# EAGLE design board (EAGLE 9.6.2)
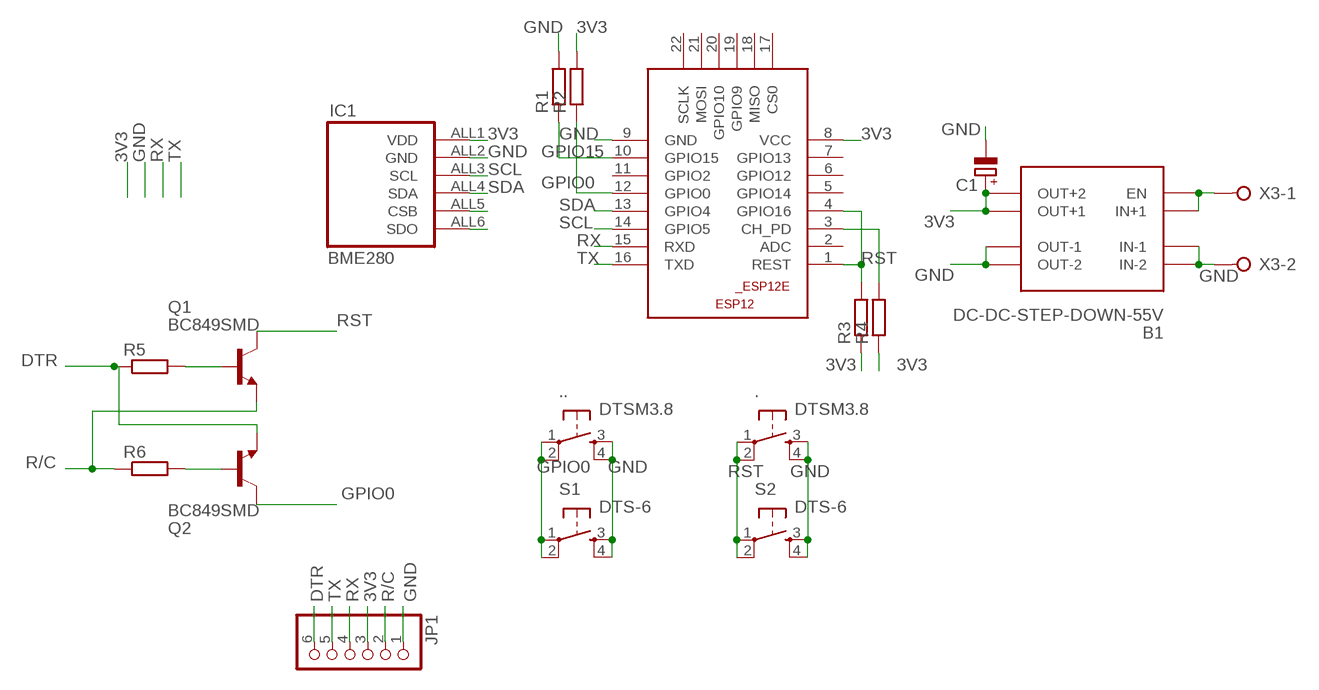
[diagram p0: schematic, sheet 1]

## Parts
.  DTSM3.8  [DTSM3.8]
..  DTSM3.8  [DTSM3.8]
B1  DC-DC-STEP-DOWN-55V  [DC-DC-STEP-DOWN-55V]
C1  CPOL-EUE1.8-4  [E1,8-4]
ESP12  ESP8266-12EESP12E  [ESP8266-ESP12E]
IC1  BME280  [BME280]
JP1  PINHD-1X6/90  [1X06/90]
Q1  BC849SMD  [SOT23-BEC]
Q2  BC849SMD  [SOT23-BEC]
R1  R-EU_R1206  [R1206]
R2  R-EU_R1206  [R1206]
R3  R-EU_0207/10  [0207/10]
R4  R-EU_0207/10  [0207/10]
R5  R-EU_R1206  [R1206]
R6  R-EU_R1206  [R1206]
S1  DTS-6  [DTS-6]
S2  DTS-6  [DTS-6]
X3  W237-02P  [W237-132]

## Nets
3V3: B1.VOUT+1(OUT+1) B1.VOUT+2(OUT+2) C1.+ ESP12.8(VCC) IC1.ALL1(VDD) JP1.3 R2.2 R3.1 R4.1
DTR: JP1.6 Q2.E R5.1
GND: ..3 ..4 ...3 ...4 B1.VIN-1(IN-1) B1.VIN-2(IN-2) B1.VOUT-1(OUT-1) B1.VOUT-2(OUT-2) C1.- ESP12.9(GND) IC1.ALL2(GND) JP1.1 R1.2 S1.3 S1.4 S2.3 S2.4 X3.2
GPIO0: ...1 ...2 ESP12.12(GPIO0) Q2.C R2.1 S1.1 S1.2
GPIO15: ESP12.10(GPIO15) R1.1
N$1: ESP12.3(CH_PD) R4.2
N$2: B1.EN B1.VIN+(IN+1) X3.1
N$3: Q1.B R5.2
N$4: Q2.B R6.2
N$6: IC1.ALL5(CSB)
N$7: IC1.ALL6(SDO)
R/C: JP1.2 Q1.E R6.1
RST: ..1 ..2 ESP12.1(REST) ESP12.4(GPIO16) Q1.C R3.2 S2.1 S2.2
RX: ESP12.15(RXD) JP1.4
SCL: ESP12.14(GPIO5) IC1.ALL3(SCL)
SDA: ESP12.13(GPIO4) IC1.ALL4(SDA)
TX: ESP12.16(TXD) JP1.5
Unconnected: ESP12.2(ADC) ESP12.5(GPIO14) ESP12.6(GPIO12) ESP12.7(GPIO13) ESP12.11(GPIO2) ESP12.17(CS0) ESP12.18(MISO) ESP12.19(GPIO9) ESP12.20(GPIO10) ESP12.21(MOSI) ESP12.22(SCLK)

## Library data of the parts
. .. = switch-tact:DTSM3.8
B1 = diy-modules:DC-DC-STEP-DOWN-55V
C1 = rcl:CPOL-EU: POLARIZED CAPACITOR, European symbol; SPICEPREFIX: C
ESP12 = esp12e:ESP8266-12E: ESP8266-12E Library for Eagle CAD The author not responsible for any damages or errors!. Created by Suhail jr.lt;/author>
IC1 = bme280:BME280: DIGITAL HUMIDITY, PRESSURE AND TEMPERATURE SENSOR * Digital interface I²C (up to 3.4 MHz) and SPI (3 and 4 wire, up to 10 MHz)* Supply voltage VDD main supply voltage range: 1.71 V to 3.6 V*VDDIO interface voltage range: 1.2 V to 3.6 V Operating range -40…+85 °C, 0…100 % rel. humidity, 300…1100 hPa The library has been designed by Richard Magdycz <https://www.facebook.com/groups/eaglecadsoftUK>
JP1 = pinhead:PINHD-1X6: PIN HEADER
Q1 Q2 = transistor-npn:BC849*: NPN Transistor
R1-R6 = rcl:R-EU_: RESISTOR, European symbol; SPICEPREFIX: R
S1 S2 = switch-tact:DTS-6
X3 = con-wago-508:W237-02P: WAGO SREW CLAMP; OC_FARNELL: unknown; OC_NEWARK: unknown

## Net classes
0 default: width 0.406 mm, drill 0.406 mm, clearance 0.406 mm

## Board
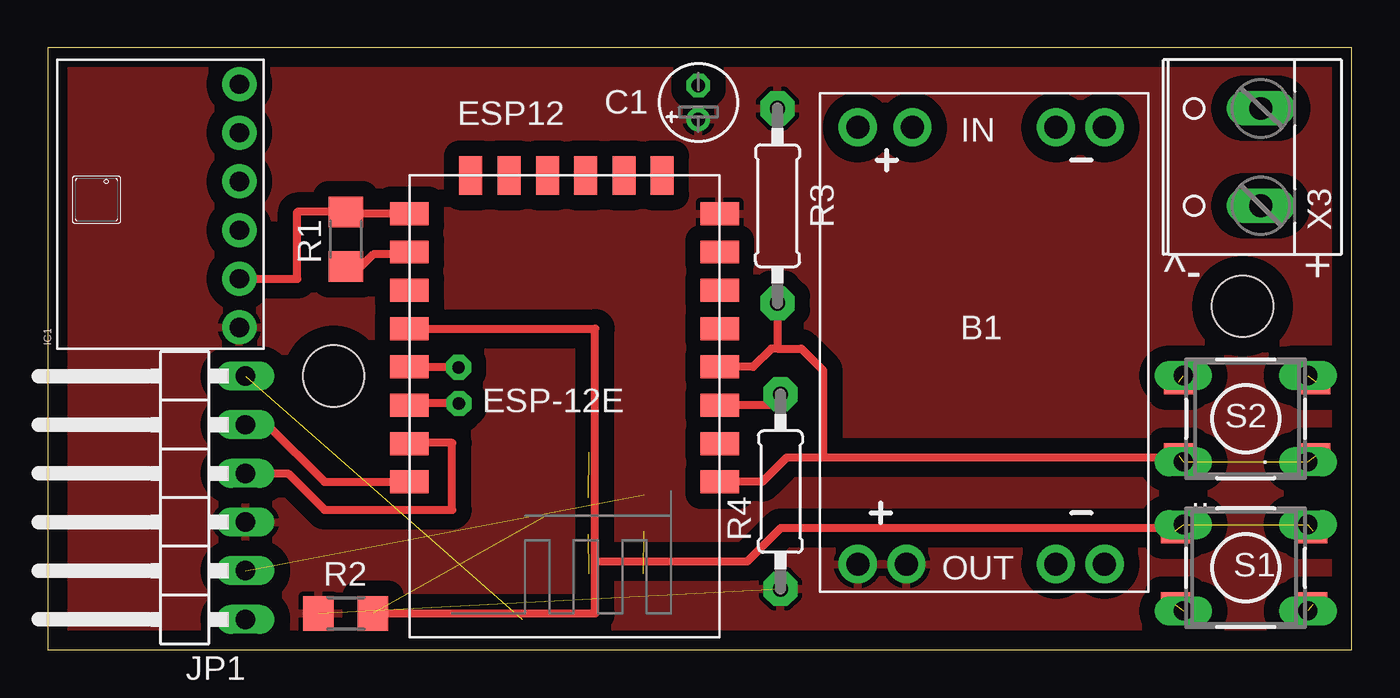
[diagram p1: board, top side]
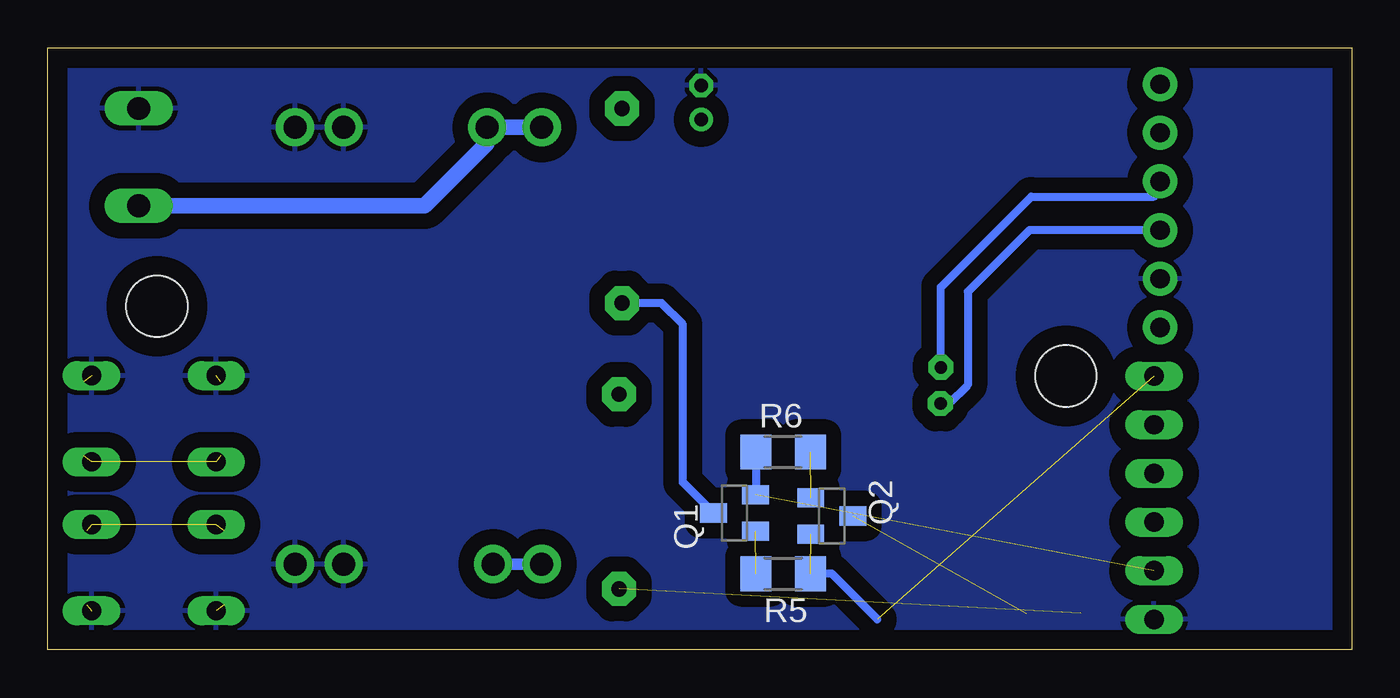
[diagram p2: board, bottom side, seen from below]

Size 68.08 x 31.42 mm. Coordinates in mm from the lower left corner, seen from the top.
Outline: 0,0 68.08,0 68.08,31.42 0,31.42 0,0
Copper layers (1*16): Top 0.035mm / dielectric 1.5mm / Bottom 0.035mm
Design rules "default": minimum track width 6mil, minimum drill 0.35mm, track to track 6mil, track to pad 6mil, pad to pad 6mil, via to via 6mil, smd to smd 6mil, copper to edge 40mil, drill to drill 6mil, minimum pad ring 10mil, minimum via ring 8mil, stop-mask expansion 4mil, vias tented up to drill 0mil, thermal gap 10mil
Holes 3.2 mm at 14.92,14.29 62.39,17.94

### Footprints (pad centres in the part's own frame; a part is rotated, then mirrored left to right if it is on the bottom)
DTSM3.8 = smd 1.55 x 1.3: 1 -3.975,1.933; 2 3.181,1.933; 3 -3.975,-1.933; 4 3.181,-1.933
DC-DC-STEP-DOWN-55V = drill 1.2 pad 2: EN 15.367,9.461; VIN+ 15.367,6.604; VIN-1 15.367,-3.429; VIN-2 15.367,-0.889; VOUT+1 -7.429,6.921; VOUT+2 -7.429,9.461; VOUT-1 -7.429,-3.429; VOUT-2 -7.429,-0.889
E1,8-4 = drill 0.711 pad 1.168: + -0.889,0 | drill 0.711 pad 1.168 octagon: - 0.889,0
ESP8266-ESP12E = smd 2 x 1.2: 1 -7.62,5.84; 2 -7.62,3.84; 3 -7.62,1.84; 4 -7.62,-0.16; 5 -7.62,-2.16; 6 -7.62,-4.16; 7 -7.62,-6.16; 8 -7.62,-8.16; 9 8.58,-8.16; 10 8.58,-6.16; 11 8.58,-4.16; 12 8.58,-2.16; 13 8.58,-0.16; 14 8.58,1.84; 15 8.58,3.84; 16 8.58,5.84 | smd 1.2 x 2: 17 -4.62,-10.16; 18 -2.62,-10.16; 19 -0.62,-10.16; 20 1.38,-10.16; 21 3.38,-10.16; 22 5.38,-10.16
BME280 = drill 1 pad 1.778: ALL1 1.111,1.429; ALL2 3.651,1.429; ALL3 6.191,1.429; ALL4 8.731,1.429; ALL5 11.271,1.429; ALL6 13.811,1.429
1X06/90 = drill 1.016 long: 1 -6.35,-3.81; 2 -3.81,-3.81; 3 -1.27,-3.81; 4 1.27,-3.81; 5 3.81,-3.81; 6 6.35,-3.81
SOT23-BEC = smd 1 x 1.4: B -0.95,-1.1; C 0,1.1; E 0.95,-1.1
R1206 = smd 1.6 x 1.803: 1 -1.422,0; 2 1.422,0
0207/10 = drill 0.8 pad 1.778 octagon: 1 -5.08,0; 2 5.08,0
DTS-6 = drill 1 long: 1 -3.25,2.25; 2 3.25,2.25; 3 -3.25,-2.25; 4 3.25,-2.25
W237-132 = drill 1.194 long: 1 -2.54,-0.635; 2 2.54,-0.635

### Placement (x,y rotation side)
.  62.23,12.06 180 top
..  62.87,4.29 0 top
B1  51.75,11.91 90 top
C1  33.97,28.57 90 top
ESP12  27.46,14.61 180 top
IC1  11.43,15.72 90 top
JP1  6.51,7.94 90 top
Q1  32.23,7.14 90 bottom
Q2  27.15,6.99 270 bottom
R1  15.56,21.43 90 top
R2  15.56,1.91 180 top
R3  38.1,23.18 270 top
R4  38.26,8.26 90 top
R5  29.69,3.97 180 bottom
R6  29.69,10.32 0 bottom
S1  62.55,4.29 0 top
S2  62.55,12.06 180 top
X3  62.71,25.72 90 top

### Tracks (layer width: path | path; a pad name or v marks a point on that pad's centre or on a via)
3V3  (1 unrouted)
  Bottom 0.61: B1.VOUT+1 B1.VOUT+2
  pour Top (isolate 0.813): 0,31.43 68.42,31.43 68.42,0 0,0
DTR  (2 unrouted)
  Bottom 0.406: R5.1 27.15,3.97 24.77,1.59
GND  (4 unrouted)
  Top 0.406: ESP12.9 15.65,22.77 R1.2 13.02,22.86 13.02,19.37 IC1.ALL2
  pour Bottom (isolate 0.813): 0,30.8 67.63,30.8 67.63,0 0,0
GPIO0  (4 unrouted)
  Top 0.406: ESP12.12 28.57,16.77 28.57,4.6 | R2.1 28.57,1.91 28.57,4.6 | ...1 58.76,6.35 38.26,6.35 36.51,4.6 28.57,4.6
GPIO15
  Top 0.406: ESP12.10 18.85,20.8 18.7,20.64 16.99,20.64 16.35,20.01 R1.1
N$1
  Top 0.406: R4.2 37.69,12.77 ESP12.3
N$2
  Bottom 0.813: X3.1 48.42,23.18 45.15,26.45 B1.VIN+ B1.EN
N$3  (1 unrouted)
N$4  (1 unrouted)
R/C  (1 unrouted)
  Bottom 0.406: Q1.E 31.11,8.11 R6.1 31.27,10.48
RST  (3 unrouted)
  Top 0.406: ESP12.1 37.31,8.77 38.58,10.04 40.48,10.04 | ESP12.4 36.83,14.77 37.78,15.72 38.1,15.72 | 38.1,15.72 39.35,15.72 40.48,14.58 40.48,10.04 | R3.2 38.1,15.72 | ..2 58.95,10.04 40.48,10.04
  Top 0.61: ESP12.1 35.24,8.61
  Bottom 0.406: Q1.C 34.92,8.74 34.92,16.99 36.04,18.1 R3.2
RX
  Top 0.406: JP1.4 12.54,9.21 14.45,7.3 21.11,7.3 21.11,10.79 18.91,10.79 ESP12.15
SCL  (via drill 0.65 pad 1.3)
  Top 0.406: ESP12.14 18.98,12.86 v21.47,12.86
  Bottom 0.406: IC1.ALL3 16.83,21.91 20.04,18.69 20.04,13.81 21,12.86 v21.47,12.86
SDA  (via drill 0.65 pad 1.3)
  Top 0.406: ESP12.13 18.86,14.75 v21.45,14.75
  Bottom 0.406: v21.45,14.75 21.45,18.93 16.72,23.65 10.32,23.65 10,23.97 IC1.ALL4
TX
  Top 0.406: ESP12.16 14.45,8.77 11.46,11.75 JP1.5

### Text on the board
tNames: ^- | +